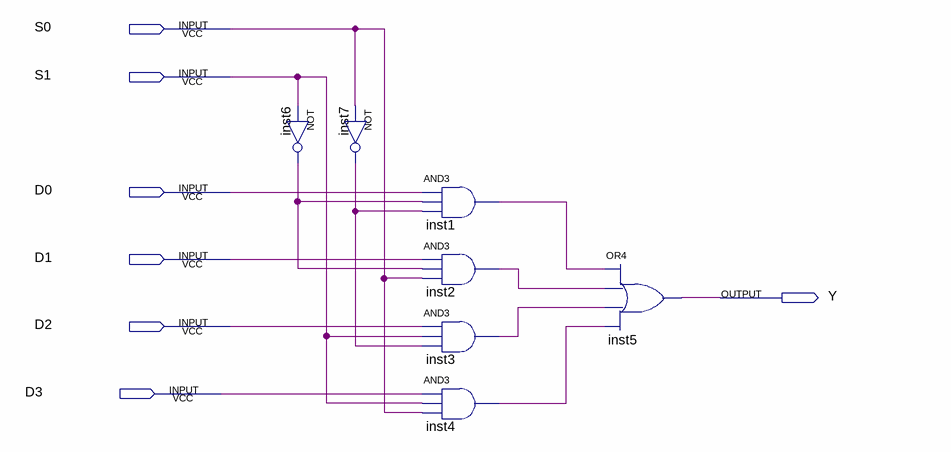
[diagram p0: schematic sheet]
// Quartus schematic Multiplexer.bdf as structural Verilog: 7 symbols, 7 pins
module Multiplexer (
  input  S0,
  input  S1,
  input  D0,
  input  D1,
  input  D2,
  input  D3,
  output Y
);

  wire inst1_out, inst2_out, inst3_out, inst4_out, inst6_out, inst7_out;

  not inst6 (inst6_out, S1);
  not inst7 (inst7_out, S0);
  and inst1 (inst1_out, D0, inst6_out, inst7_out);
  and inst2 (inst2_out, D1, inst6_out, S0);
  and inst3 (inst3_out, D2, S1, inst7_out);
  and inst4 (inst4_out, D3, S1, S0);
  or inst5 (Y, inst1_out, inst2_out, inst3_out, inst4_out);
endmodule
